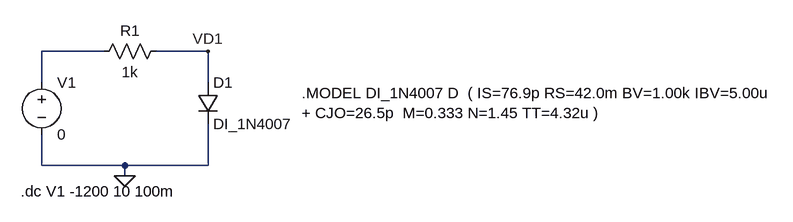
[diagram p0: schematic 1N4007.asc]
1N4007.asc, the LTspice schematic file:
Version 4.1
SHEET 1 1868 680
WIRE 80 64 -16 64
WIRE 240 64 160 64
WIRE -16 112 -16 64
WIRE 240 112 240 64
WIRE -16 240 -16 192
WIRE 112 240 -16 240
WIRE 240 240 240 176
WIRE 240 240 112 240
WIRE 112 256 112 240
FLAG 112 256 0
FLAG 240 64 VD1
SYMBOL voltage -16 96 R0
WINDOW 123 0 0 Left 0
WINDOW 39 0 0 Left 0
SYMATTR InstName V1
SYMATTR Value 0
SYMBOL diode 224 112 R0
SYMATTR InstName D1
SYMATTR Value DI_1N4007
SYMBOL res 176 48 R90
WINDOW 0 0 56 VBottom 2
WINDOW 3 32 56 VTop 2
SYMATTR InstName R1
SYMATTR Value 1k
TEXT -48 280 Left 2 !.dc V1 -1200 10 100m
TEXT 384 128 Left 2 !.MODEL DI_1N4007 D  ( IS=76.9p RS=42.0m BV=1.00k IBV=5.00u\n+ CJO=26.5p  M=0.333 N=1.45 TT=4.32u )

The netlist it stands for:
* 1N4007.asc
V1 N001 0 0
D1 VD1 0 DI_1N4007
R1 VD1 N001 1k
.model D D
.lib standard.dio
.dc V1 -1200 10 100m
.MODEL DI_1N4007 D  ( IS=76.9p RS=42.0m BV=1.00k IBV=5.00u
+ CJO=26.5p  M=0.333 N=1.45 TT=4.32u )
.backanno
.end